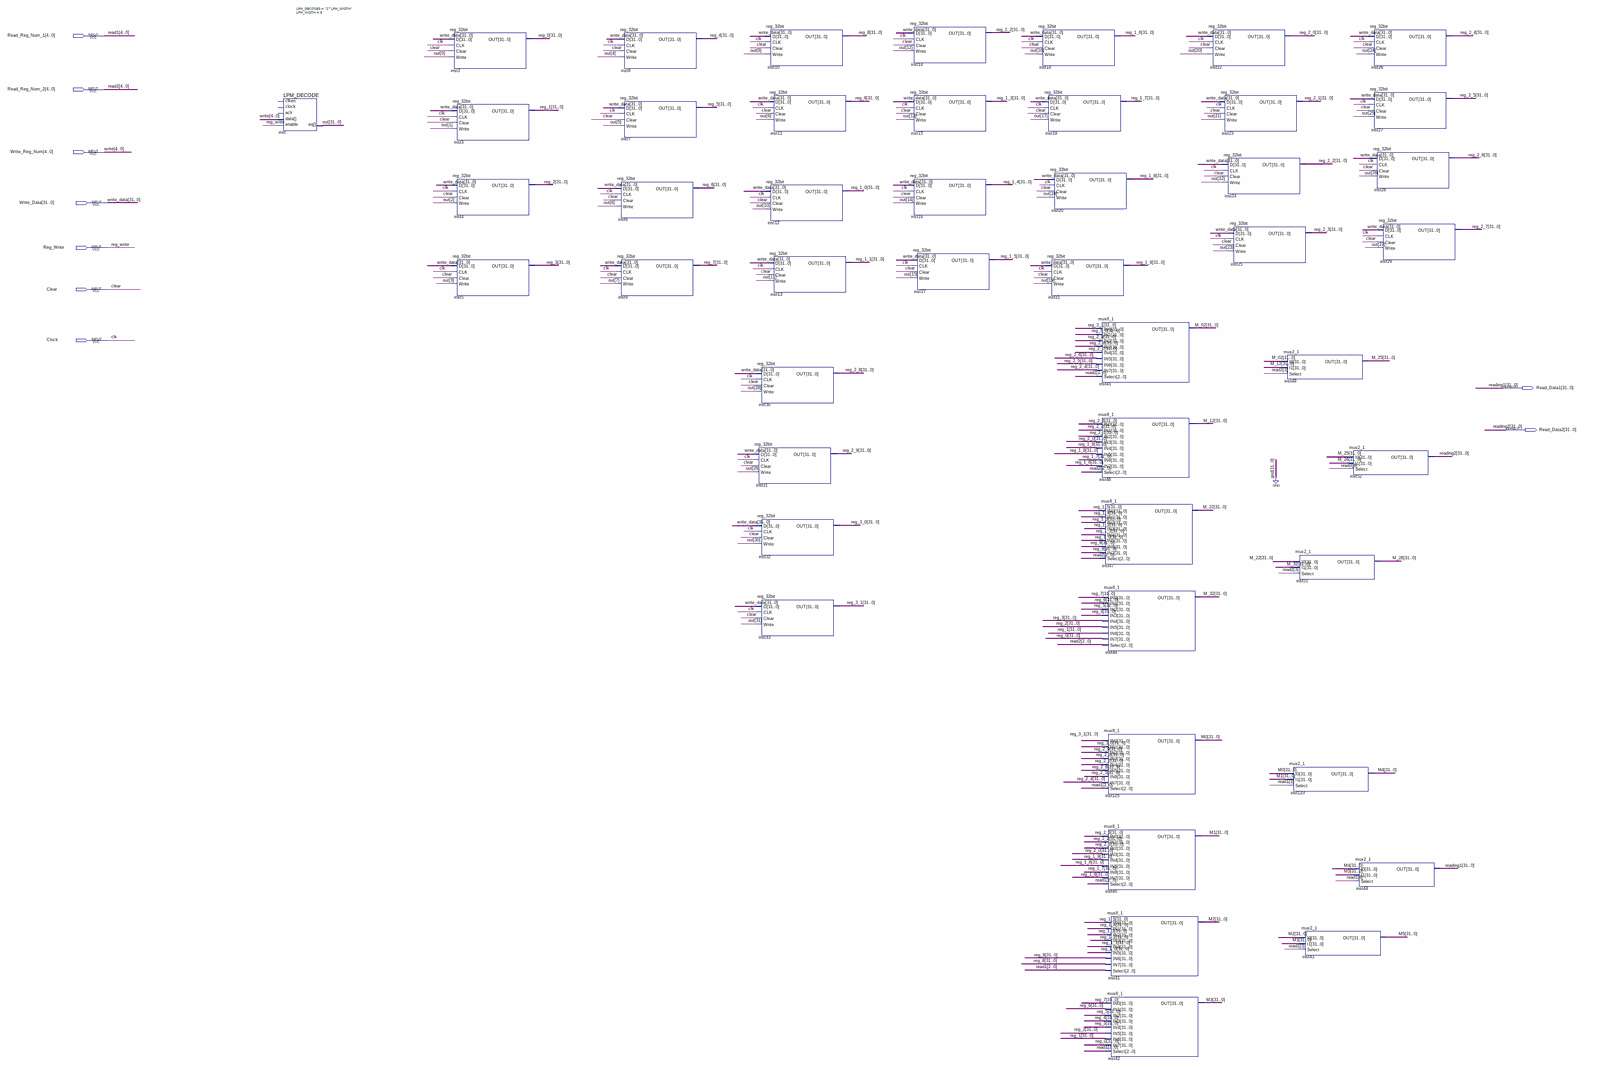
[diagram p0: schematic sheet, whole]
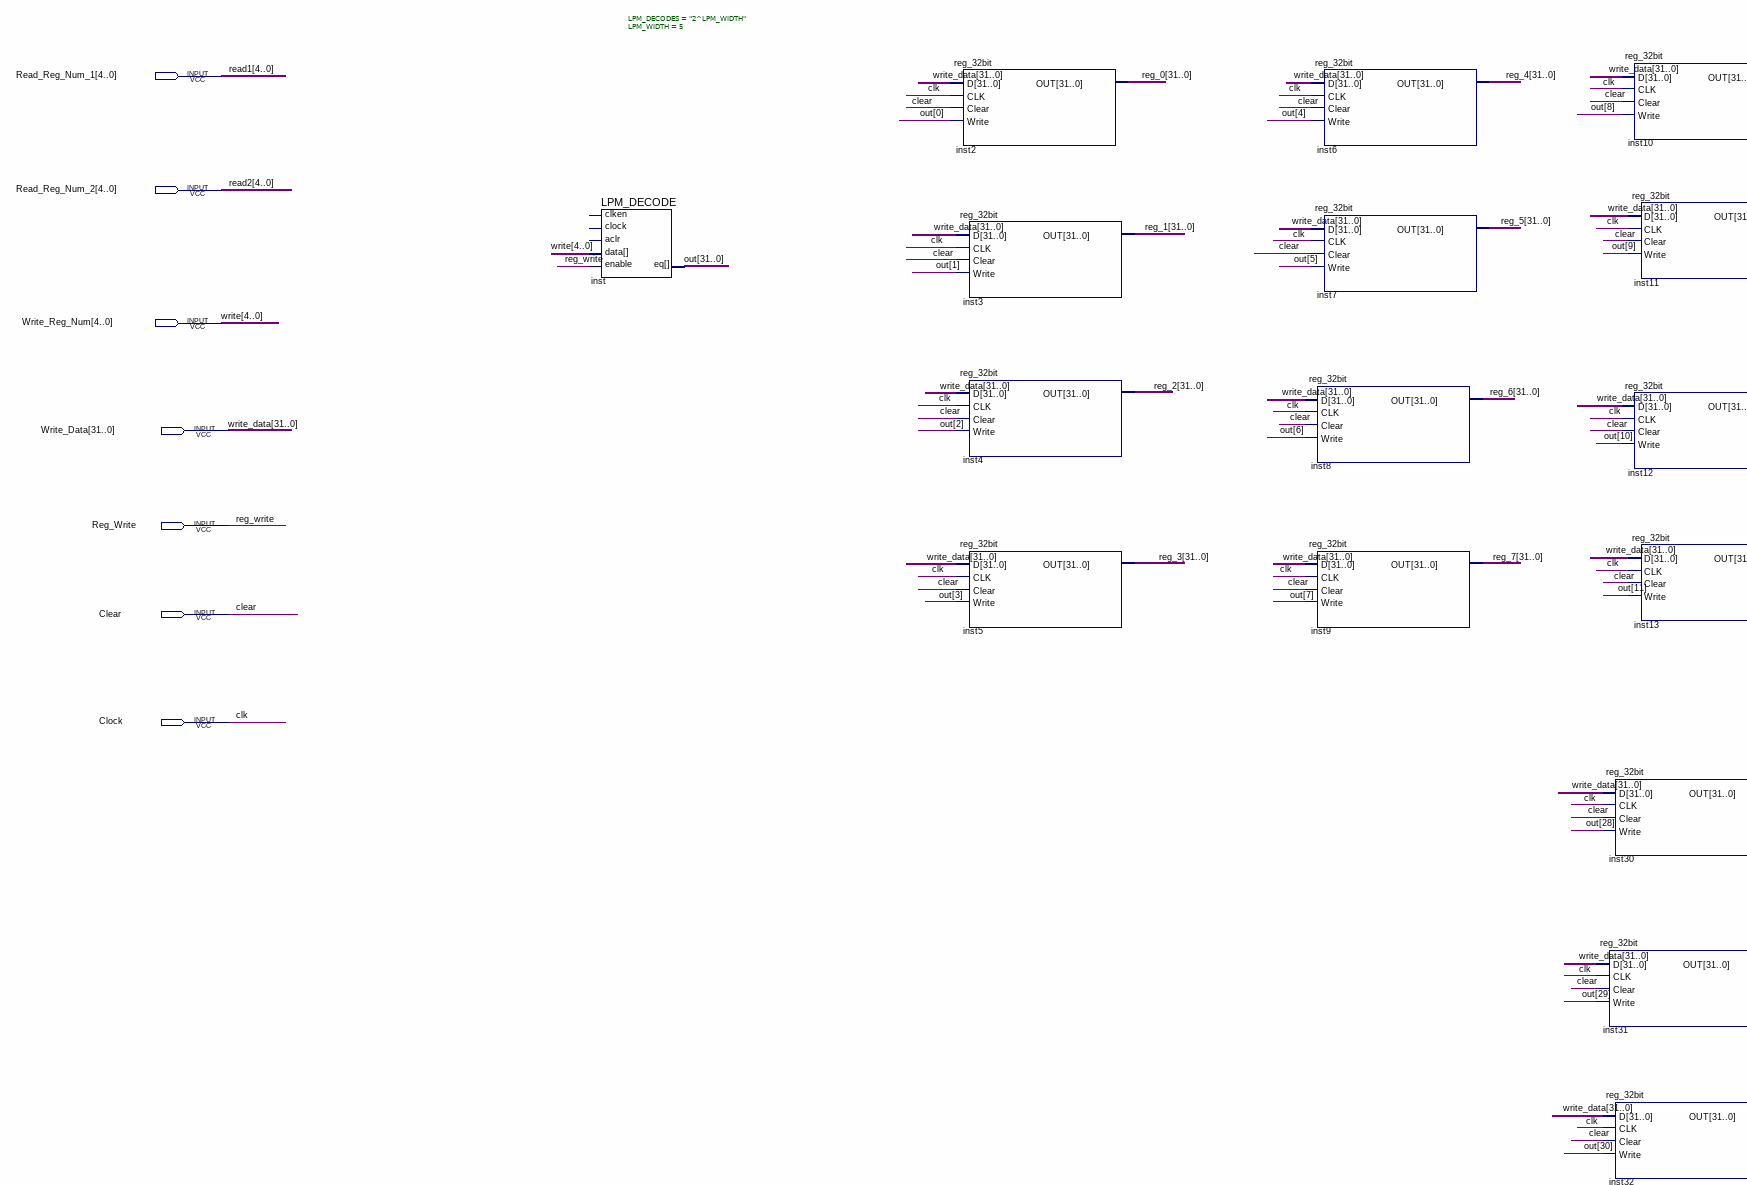
[diagram p1: schematic sheet, upper left part]
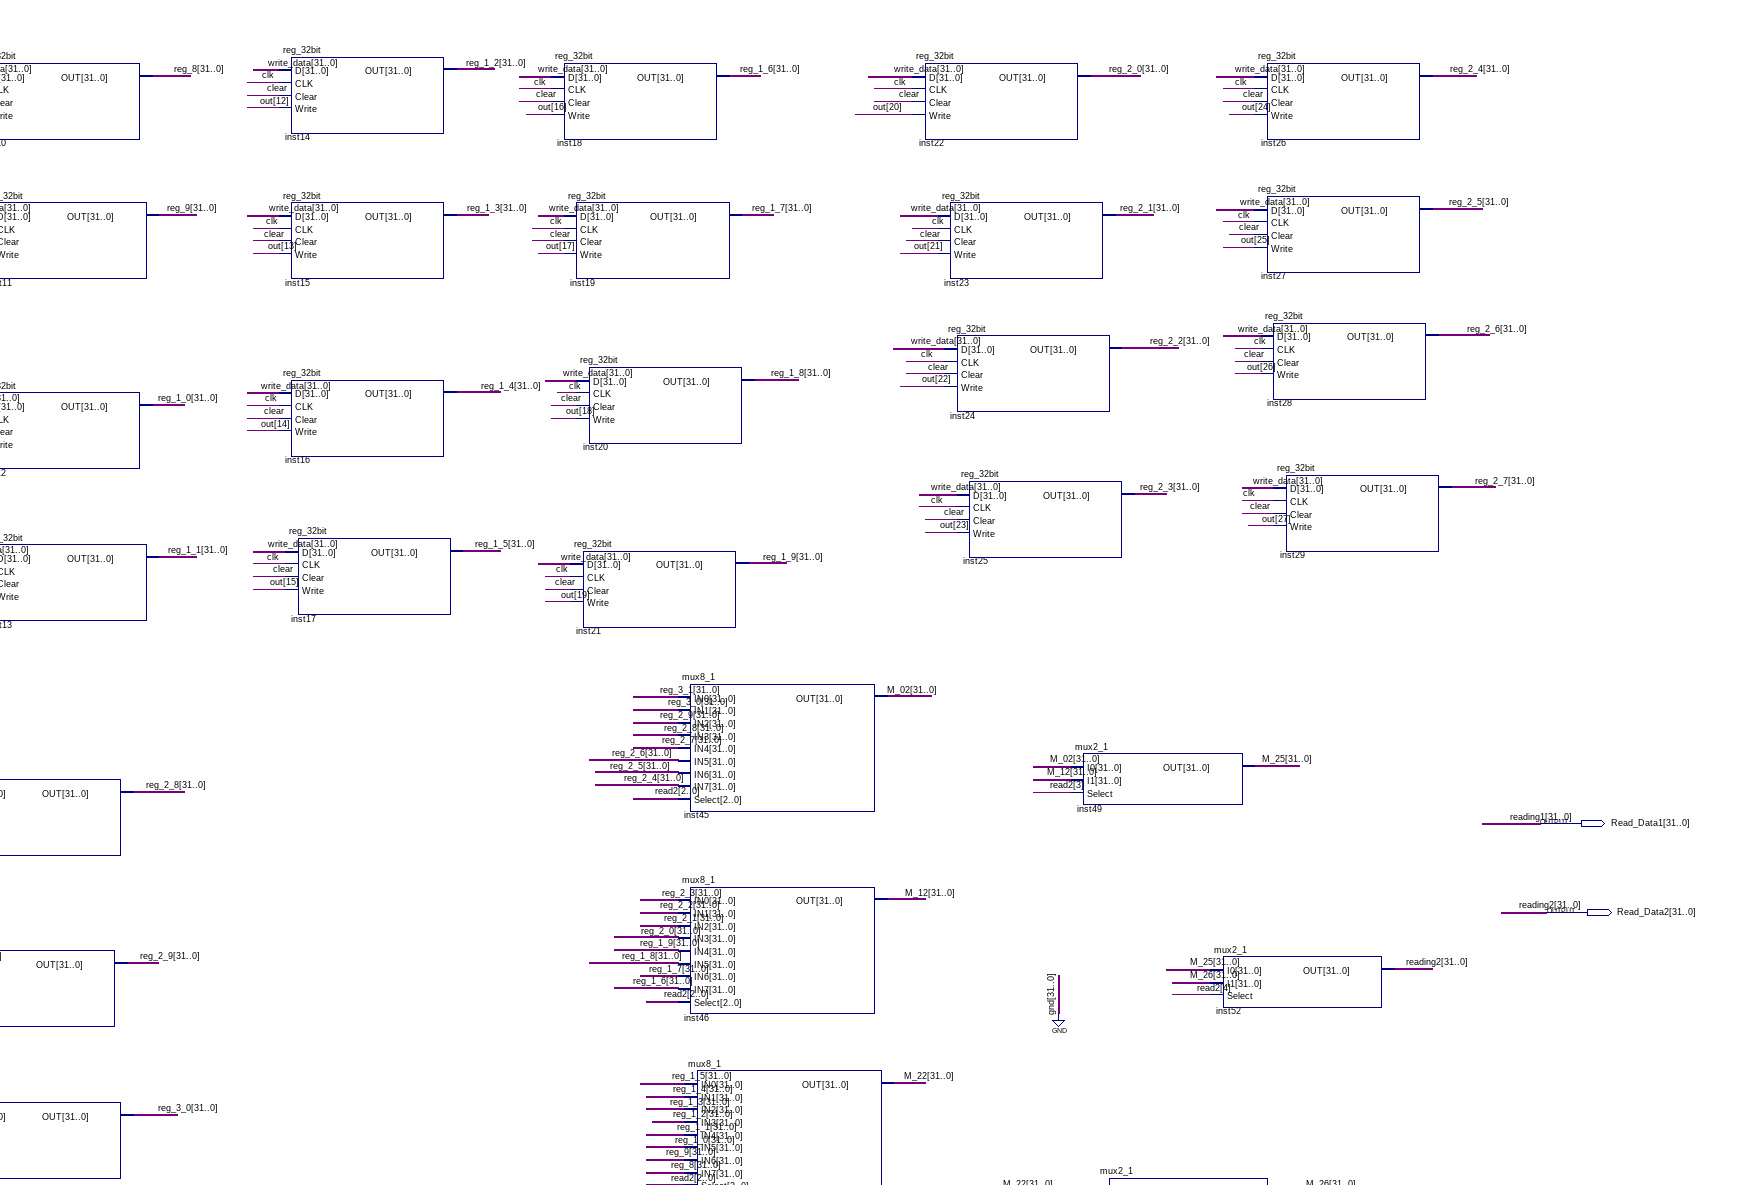
[diagram p2: schematic sheet, upper right part]
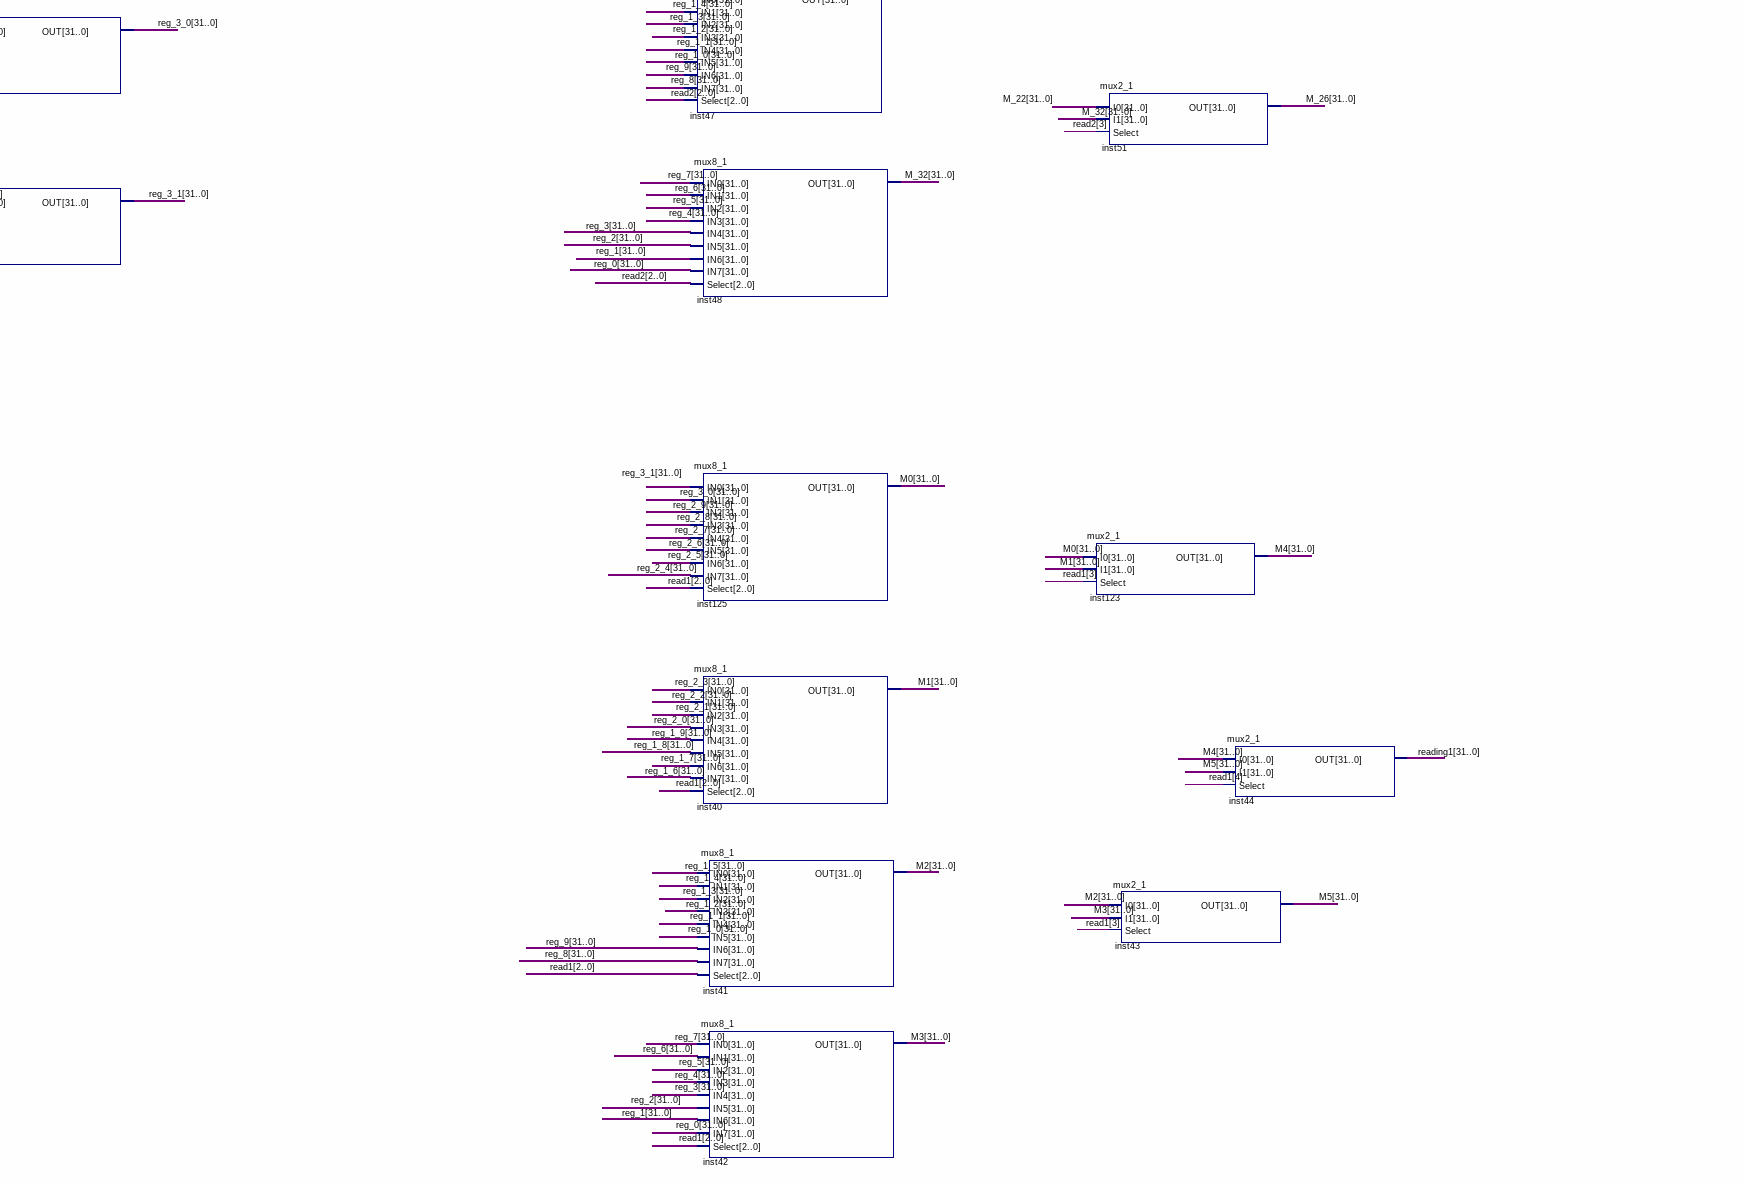
[diagram p3: schematic sheet, lower right part]
// Quartus schematic Register_File.bdf as structural Verilog: 47 symbols, 9 pins
module Register_File (
  input  [4:0] Read_Reg_Num_1,
  input  [4:0] Read_Reg_Num_2,
  input  [4:0] Write_Reg_Num,
  input  [31:0] Write_Data,
  input  Reg_Write,
  input  Clear,
  input  Clock,
  output [31:0] Read_Data1,
  output [31:0] Read_Data2
);

  wire [31:0] M0, M1, M2, M3, M4, M5, M_02, M_12, M_22, M_25, M_26, M_32, out, reg_0, reg_1, reg_1_0,
       reg_1_1, reg_1_2, reg_1_3, reg_1_4, reg_1_5, reg_1_6, reg_1_7, reg_1_8, reg_1_9, reg_2, reg_2_0,
       reg_2_1, reg_2_2, reg_2_3, reg_2_4, reg_2_5, reg_2_6, reg_2_7, reg_2_8, reg_2_9, reg_3, reg_3_0,
       reg_3_1, reg_4, reg_5, reg_6, reg_7, reg_8, reg_9;

  LPM_DECODE #(.LPM_DECODES("2^LPM_WIDTH"), .LPM_WIDTH(5)) inst (
    .enable(Reg_Write), .data(Write_Reg_Num), .eq(out));  // open: clken, clock, aclr
  reg_32bit inst2 (.D(Write_Data), .CLK(Clock), .Clear(Clear), .Write(out[0]), .OUT(reg_0));
  reg_32bit inst3 (.D(Write_Data), .CLK(Clock), .Clear(Clear), .Write(out[1]), .OUT(reg_1));
  reg_32bit inst4 (.D(Write_Data), .CLK(Clock), .Clear(Clear), .Write(out[2]), .OUT(reg_2));
  reg_32bit inst5 (.D(Write_Data), .CLK(Clock), .Clear(Clear), .Write(out[3]), .OUT(reg_3));
  reg_32bit inst6 (.D(Write_Data), .CLK(Clock), .Clear(Clear), .Write(out[4]), .OUT(reg_4));
  reg_32bit inst7 (.D(Write_Data), .CLK(Clock), .Clear(Clear), .Write(out[5]), .OUT(reg_5));
  reg_32bit inst8 (.D(Write_Data), .CLK(Clock), .Clear(Clear), .Write(out[6]), .OUT(reg_6));
  reg_32bit inst9 (.D(Write_Data), .CLK(Clock), .Clear(Clear), .Write(out[7]), .OUT(reg_7));
  reg_32bit inst31 (.D(Write_Data), .CLK(Clock), .Clear(Clear), .Write(out[29]), .OUT(reg_2_9));
  reg_32bit inst10 (.D(Write_Data), .CLK(Clock), .Clear(Clear), .Write(out[8]), .OUT(reg_8));
  reg_32bit inst11 (.D(Write_Data), .CLK(Clock), .Clear(Clear), .Write(out[9]), .OUT(reg_9));
  reg_32bit inst12 (.D(Write_Data), .CLK(Clock), .Clear(Clear), .Write(out[10]), .OUT(reg_1_0));
  reg_32bit inst13 (.D(Write_Data), .CLK(Clock), .Clear(Clear), .Write(out[11]), .OUT(reg_1_1));
  reg_32bit inst30 (.D(Write_Data), .CLK(Clock), .Clear(Clear), .Write(out[28]), .OUT(reg_2_8));
  reg_32bit inst32 (.D(Write_Data), .CLK(Clock), .Clear(Clear), .Write(out[30]), .OUT(reg_3_0));
  reg_32bit inst33 (.D(Write_Data), .CLK(Clock), .Clear(Clear), .Write(out[31]), .OUT(reg_3_1));
  reg_32bit inst14 (.D(Write_Data), .CLK(Clock), .Clear(Clear), .Write(out[12]), .OUT(reg_1_2));
  reg_32bit inst15 (.D(Write_Data), .CLK(Clock), .Clear(Clear), .Write(out[13]), .OUT(reg_1_3));
  reg_32bit inst16 (.D(Write_Data), .CLK(Clock), .Clear(Clear), .Write(out[14]), .OUT(reg_1_4));
  reg_32bit inst17 (.D(Write_Data), .CLK(Clock), .Clear(Clear), .Write(out[15]), .OUT(reg_1_5));
  reg_32bit inst18 (.D(Write_Data), .CLK(Clock), .Clear(Clear), .Write(out[16]), .OUT(reg_1_6));
  reg_32bit inst19 (.D(Write_Data), .CLK(Clock), .Clear(Clear), .Write(out[17]), .OUT(reg_1_7));
  reg_32bit inst20 (.D(Write_Data), .CLK(Clock), .Clear(Clear), .Write(out[18]), .OUT(reg_1_8));
  reg_32bit inst21 (.D(Write_Data), .CLK(Clock), .Clear(Clear), .Write(out[19]), .OUT(reg_1_9));
  mux8_1 inst45 (
    .IN0(reg_3_1), .IN1(reg_3_0), .IN2(reg_2_9), .IN3(reg_2_8), .IN4(reg_2_7), .IN5(reg_2_6), .IN6(reg_2_5),
    .IN7(reg_2_4), .Select(Read_Reg_Num_2[2:0]), .OUT(M_02));
  mux8_1 inst46 (
    .IN0(reg_2_3), .IN1(reg_2_2), .IN2(reg_2_1), .IN3(reg_2_0), .IN4(reg_1_9), .IN5(reg_1_8), .IN6(reg_1_7),
    .IN7(reg_1_6), .Select(Read_Reg_Num_2[2:0]), .OUT(M_12));
  mux8_1 inst47 (
    .IN0(reg_1_5), .IN1(reg_1_4), .IN2(reg_1_3), .IN3(reg_1_2), .IN4(reg_1_1), .IN5(reg_1_0), .IN6(reg_9),
    .IN7(reg_8), .Select(Read_Reg_Num_2[2:0]), .OUT(M_22));
  mux8_1 inst48 (
    .IN0(reg_7), .IN1(reg_6), .IN2(reg_5), .IN3(reg_4), .IN4(reg_3), .IN5(reg_2), .IN6(reg_1), .IN7(reg_0),
    .Select(Read_Reg_Num_2[2:0]), .OUT(M_32));
  mux8_1 inst125 (
    .IN0(reg_3_1), .IN1(reg_3_0), .IN2(reg_2_9), .IN3(reg_2_8), .IN4(reg_2_7), .IN5(reg_2_6), .IN6(reg_2_5),
    .IN7(reg_2_4), .Select(Read_Reg_Num_1[2:0]), .OUT(M0));
  mux8_1 inst40 (
    .IN0(reg_2_3), .IN1(reg_2_2), .IN2(reg_2_1), .IN3(reg_2_0), .IN4(reg_1_9), .IN5(reg_1_8), .IN6(reg_1_7),
    .IN7(reg_1_6), .Select(Read_Reg_Num_1[2:0]), .OUT(M1));
  mux8_1 inst41 (
    .IN0(reg_1_5), .IN1(reg_1_4), .IN2(reg_1_3), .IN3(reg_1_2), .IN4(reg_1_1), .IN5(reg_1_0), .IN6(reg_9),
    .IN7(reg_8), .Select(Read_Reg_Num_1[2:0]), .OUT(M2));
  mux8_1 inst42 (
    .IN0(reg_7), .IN1(reg_6), .IN2(reg_5), .IN3(reg_4), .IN4(reg_3), .IN5(reg_2), .IN6(reg_1), .IN7(reg_0),
    .Select(Read_Reg_Num_1[2:0]), .OUT(M3));
  reg_32bit inst22 (.D(Write_Data), .CLK(Clock), .Clear(Clear), .Write(out[20]), .OUT(reg_2_0));
  reg_32bit inst23 (.D(Write_Data), .CLK(Clock), .Clear(Clear), .Write(out[21]), .OUT(reg_2_1));
  reg_32bit inst24 (.D(Write_Data), .CLK(Clock), .Clear(Clear), .Write(out[22]), .OUT(reg_2_2));
  reg_32bit inst25 (.D(Write_Data), .CLK(Clock), .Clear(Clear), .Write(out[23]), .OUT(reg_2_3));
  mux2_1 inst49 (.I0(M_02), .I1(M_12), .Select(Read_Reg_Num_2[3]), .OUT(M_25));
  mux2_1 inst51 (.I0(M_22), .I1(M_32), .Select(Read_Reg_Num_2[3]), .OUT(M_26));
  mux2_1 inst123 (.I0(M0), .I1(M1), .Select(Read_Reg_Num_1[3]), .OUT(M4));
  mux2_1 inst43 (.I0(M2), .I1(M3), .Select(Read_Reg_Num_1[3]), .OUT(M5));
  mux2_1 inst52 (.I0(M_25), .I1(M_26), .Select(Read_Reg_Num_2[4]), .OUT(Read_Data2));
  reg_32bit inst26 (.D(Write_Data), .CLK(Clock), .Clear(Clear), .Write(out[24]), .OUT(reg_2_4));
  reg_32bit inst27 (.D(Write_Data), .CLK(Clock), .Clear(Clear), .Write(out[25]), .OUT(reg_2_5));
  reg_32bit inst28 (.D(Write_Data), .CLK(Clock), .Clear(Clear), .Write(out[26]), .OUT(reg_2_6));
  mux2_1 inst44 (.I0(M4), .I1(M5), .Select(Read_Reg_Num_1[4]), .OUT(Read_Data1));
  reg_32bit inst29 (.D(Write_Data), .CLK(Clock), .Clear(Clear), .Write(out[27]), .OUT(reg_2_7));

  // Other names for the same wires on the sheet: clk = Clock; read1[4:0] = Read_Reg_Num_1;
  //   read2[4:0] = Read_Reg_Num_2; reading1[31:0] = Read_Data1; reading2[31:0] = Read_Data2;
  //   write[4:0] = Write_Reg_Num
endmodule
